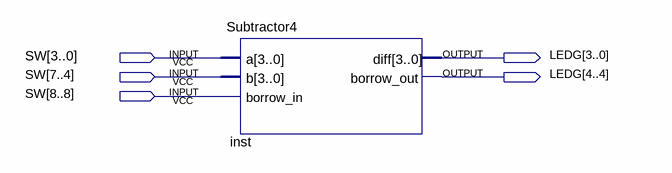
[diagram p0: schematic sheet]
// Quartus schematic block_subtractor4.bdf as structural Verilog: 1 symbols, 5 pins
module block_subtractor4 (
  input  [8:0] SW,
  output [4:0] LEDG
);

  Subtractor4 inst (.a(SW[3:0]), .b(SW[7:4]), .borrow_in(SW[8]), .diff(LEDG[3:0]), .borrow_out(LEDG[4]));
endmodule
